# EAGLE design Adafruit MOSFET Driver STEMMA Breakout (EAGLE 9.6.2)
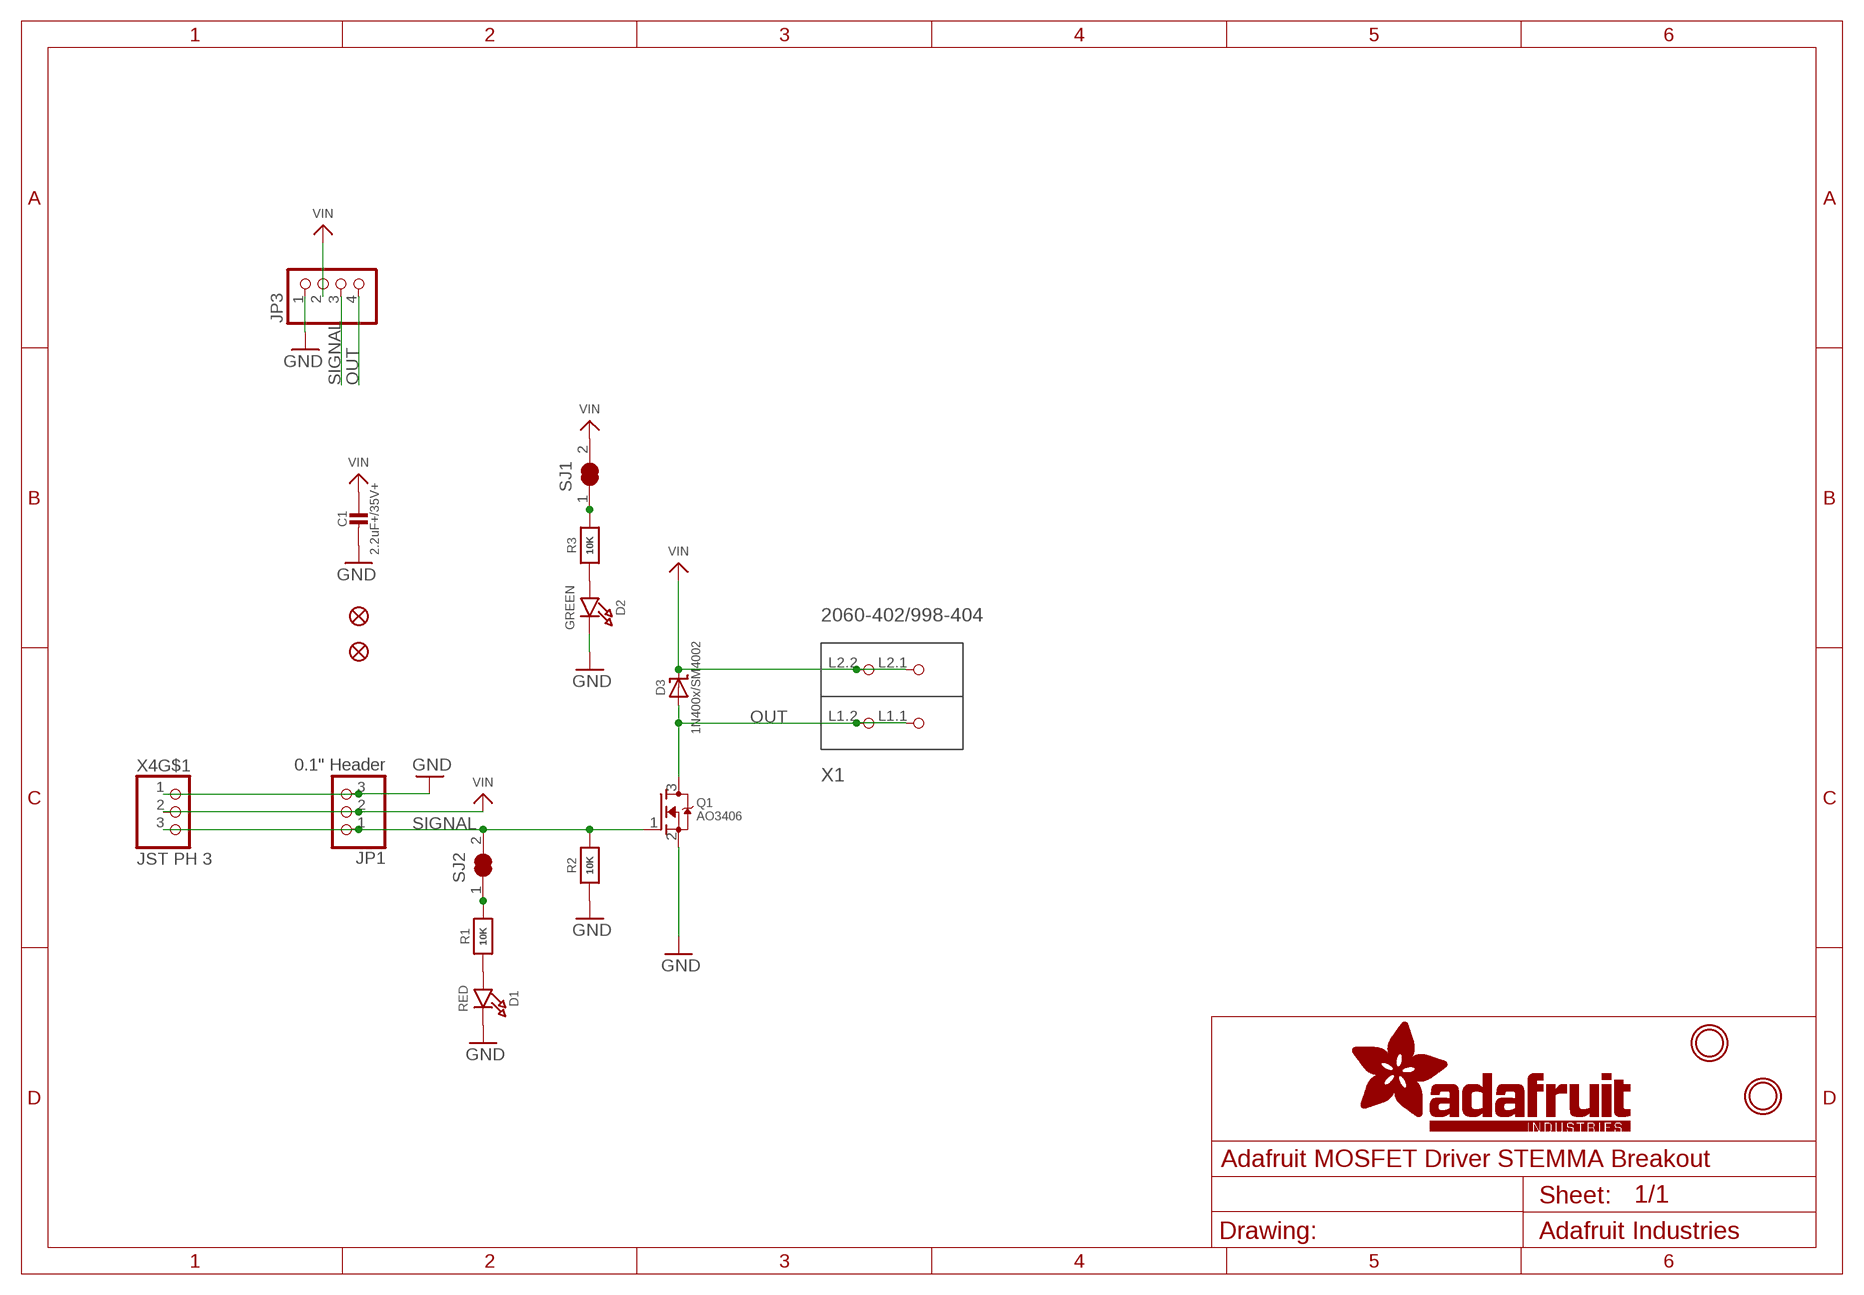
[diagram p0: schematic, sheet 1]

## Parts
C1  2.2uF+/35V+  CAP_CERAMIC0805-NOOUTLINE  [0805-NO]
D1  RED  LED0603_NOOUTLINE  [CHIPLED_0603_NOOUTLINE]
D2  GREEN  LED0603_NOOUTLINE  [CHIPLED_0603_NOOUTLINE]
D3  1N400x/SM4002  DIODE-SCHOTTKYSOD-123  [SOD-123]
FID2  FIDUCIAL_1MM  [FIDUCIAL_1MM]
FID3  FIDUCIAL_1MM  [FIDUCIAL_1MM]
JP1  0.1" Header  HEADER-1X3  [1X03_OVAL]
JP3  HEADER-1X4ROUND  [1X04_ROUND]
Q1  AO3406  MOSFET-NWIDE  [SOT23-WIDE]
R1  10K  RESISTOR_0603_NOOUT  [0603-NO]
R2  10K  RESISTOR_0603_NOOUT  [0603-NO]
R3  10K  RESISTOR_0603_NOOUT  [0603-NO]
SJ1  SOLDERJUMPER_CLOSED  [SOLDERJUMPER_CLOSEDWIRE]
SJ2  SOLDERJUMPER_CLOSED  [SOLDERJUMPER_CLOSEDWIRE]
U$1  MOUNTINGHOLE2.5  [MOUNTINGHOLE_2.5_PLATED]
U$8  MOUNTINGHOLE2.5  [MOUNTINGHOLE_2.5_PLATED]
X1  2060-402/998-404  [P-2060-402/998-404]
X4  JST PH 3  CON_JST_PH_3PIN  [JSTPH3]

## Nets
GND: C1.2 D1.C D2.C JP1.3 JP3.1 Q1.2(S) R2.1 X4.1
N$1: R3.2 SJ1.1
N$2: D1.A R1.1
N$3: R1.2 SJ2.1
N$26: D2.A R3.1
OUT: D3.A JP3.4 Q1.3(D) X1.L1.1(P1.1) X1.L1.2(P1.2)
SIGNAL: JP1.1 JP3.3 Q1.1(G) R2.2 SJ2.2 X4.3
VIN: C1.1 D3.C JP1.2 JP3.2 SJ1.2 X1.L2.1(P2.1) X1.L2.2(P2.2) X4.2
Unconnected: X4.NC1(MT) X4.NC2(MT)

## Library data of the parts
C1 = microbuilder:CAP_CERAMIC: Ceramic Capacitors For new designs, use the packages preceded by an '_' character since they are more reliable: The following footprints should be used on most boards: _0402 - Standard footprint for regular board layouts _0603 - Standard footprint for regular board layouts _0805 - Standard footprint for regular board layouts _1206 - Standard footprint for regular board layouts For extremely tight-pitch boards where space is at a premium, the following 'micro-pitch' footprints can be used (smaller pads, no silkscreen outline, etc.): _0402MP - Micro-pitch footprint for very dense/compact boards _0603MP - Micro-pitch footprint for very dense/compact boards _0805MP - Micro-pitch footprint for very dense/compact boards _1206MP - Micro-pitch footprint for very dense/compact boards
D1 D2 = microbuilder:LED: LED 0603 - 0603 Surface Mount Package 2mA: Green LED - Low Power (3.9mcd, 2ma, 1.7Vf) - Digikey: 475-2709-2-ND Orange LED - Low Power (9.8mcd, 2ma, 1.8Vf) - Digikey: 475-1194-2-ND Red LED - Low Power (5mcd, 2ma, 1.8Vf) - Digikey: 475-1195-2-ND Yellow LED - Low Power (7mcd, 2ma, 1.8Vf) - Digikey: 475-1196-2-ND 5mA: Blue LED - Low Power (17mcd, 5ma, 2.9Vf) - Digikey: LNJ937W8CRACT-ND 0805 - 0805 Surface Mount Package 2mA: Red LED (8.8mcd, 2mA, 1.8Vf, Clear) - Low Power [Digikey: 475-2510-1-ND] Green LED (5mcd, 2mA, 1.8Vf, Clear) - Low Power [Digikey: 475-2730-1-ND] Yellow LED (11.3mcd, 2mA, 1.8Vf, Clear) - Low Power [Digikey: 475-2555-1-ND] 20mA: Red LED (104mcd, 20mA, Diffused) - LS R976 [Digikey: 475-1278-6-ND] Red LED (12mcd, 20mA, 2.0Vf, Clear) - APT2012EC [Digikey: 754-1128-1-ND] Green LED (15mcd, 20mA, 2.2Vf, Clear) - APT2012GC [Digikey: 754-1131-1-ND] Orange LED (160mcd, 20mA, 2.1Vf, Clear) - APT2012SECK [Digikey: 754-1130-1-ND] 1206 - 1206 Surface Mount Package Green LED (26mcd, 20mA, Diffused) - LG N971 [Digikey: 475-1407-6-ND] Red LED (15mcd, 20mA, Diffused) - LH N974 [Digikey: 475-1416-6-ND] Cree - Cree High-Power Surface Mount LEDs XPEBWT-L1-0000-00D50 - White 111lm 350mA 2.9Vf 6200K 110° XTEAWT-00-0000-00000LEE3 - White 114lm 350mA 2.85Vf 5000K 115° Everlight - Everlight 45-21 Series Surface Mount LEDs 45-21/QK2C-B2832AC2CB2/2T - Warm White 2000mcd 20mA 3.25Vf 3050K 120° 45-21/LK2C-B38452C4CB2/2T - Nuetral White 2000mcd 20mA 3.25Vf 4150K 120° 45-21/LK2C-B50634C6CB2/2T - Cold White 2200mcd 20mA 3.25Vf 5650K 120° PLCC2 Reverse Mount LS T77K-J1L2-1-0-2-R18-Z - Red 11.25mcd 2mA 1.8Vf 630nm 120° LO T77K-L1M2-24-Z - Orange 19.6mcd 2mA 1.8Vf 606nm 120° LY T77K-K2M1-26-Z - Yellow 15.7mcd 2mA 1.8Vf 587nm 120°; ROT: 270
D3 = microbuilder:DIODE-SCHOTTKY
FID2 FID3 = microbuilder:FIDUCIAL: Fiducial Alignment Points Various fiducial points for machine vision alignment.; BOM: EXCLUDE
JP1 = microbuilder:HEADER-1X3: PIN HEADER
JP3 = microbuilder:HEADER-1X4: PIN HEADER
Q1 = microbuilder:MOSFET-N: N-Channel Mosfet LEGEND VDS: Voltage Drain-Source ID: Drain Current RDS(ON): Drain-Source On-State Resistance VGS(TH): Gate-Source Threshold Voltage CISS: Drain-Source Input Capacitance SOT-23 Name VDS ID RDS(ON) VGS(TH) CISS Order Number 2N7002E 60V 260mA 2.5 Ohm 2.5V @ 250uA 26.7pF @ 25V 2N7002ET1GOSTR-ND BSH103 30V 850mA 400 mOhm 400mV @ 1mA 83pF @ 24V BSH103,235-ND BSS138 60V 320mA 1.6 Ohm 1.5V @ 250uA 50pF @ 10V Mouser: 771-BSS138PW115 DMN2075U-7 20V 4.2A 38 mOhm 1V @ 250 uA 594.3pF @ 10V DMN2075U-7DICT-ND * BSS138 good choice for I2C level-shifting POWERPAK 1212-8 Name VDS ID RDS(ON) VGS(TH) CISS Order Number Si7308DN 60V 6A 58 mOhm 3V @ 250uA 665pF @ 15V SI7308DN-T1-E3CT-ND
R1-R3 = microbuilder:RESISTOR: Resistors For new designs, use the packages preceded by an '_' character since they are more reliable: The following footprints should be used on most boards: _0402 - Standard footprint for regular board layouts _0603 - Standard footprint for regular board layouts _0805 - Standard footprint for regular board layouts _1206 - Standard footprint for regular board layouts For extremely tight-pitch boards where space is at a premium, the following 'micro-pitch' footprints can be used (smaller pads, no silkscreen outline, etc.): _0402MP - Micro-pitch footprint for very dense/compact boards _0603MP - Micro-pitch footprint for very dense/compact boards _0805MP - Micro-pitch footprint for very dense/compact boards _1206MP - Micro-pitch footprint for very dense/compact boards
SJ1 SJ2 = microbuilder:SOLDERJUMPER_CLOSED: Solder Jumper - Closed These solder jumpers are closed by default CLOSEDWIRE - 10 mil trace between pads that can be cut and resoldered later CLOSEDPERM - 63 mil trace between pads for a permanent connection (used to 'bridge' two signals, a shameless hack for Eagle). Can double as a test point as well (no cream layer)
U$1 U$8 = adafruit_electromech:MOUNTINGHOLE: Mounting Hole For #2 screws (0.086"/2.18mm width, 0.094"/2.4mm hole) use 2.5mm; BOM: EXCLUDE
X1 = adafruit_electromech:2060-402/998-404: Serie 2060, SMD-Leiterplattenklemme mit Betätigungsdrückern im Gurt 2-polig / Series 2060, SMD terminal block with push-buttons in tape-and-reel packing 2-pole Polzahl / Pole No.: 2 Rastermaß / Pitch: 4 mm Bemessungsspannung / Rated Voltage: 160 V Nennstrom / Nominal Current: 9 A Leiterquerschnitt / Conductor Size: 0.2 - 0.75 mm2 Anschlusstechnik / Connection Technology: CAGE CLAMP® S Leitereinführung (zur Platine) / Conductor entry angle (to PCB): 0 ° Farbe / Color: lichtgrau / light gray Stand: 01.01.2014. Die jeweils aktuellen Daten zu diesem Artikel finden Sie in unserem Produktkatalog, den Sie unter www.wago.com einsehen können. As of: 01/01/2014. Please find the newest data for this article in our product catalogue, which can be viewed under www.wago.com.; ROT: 180
X4 = adafruit_electromech:CON_JST_PH_3PIN

## Net classes
1 HV: width 0.406 mm, drill 0.381 mm, clearance 0.762 mm

## Board
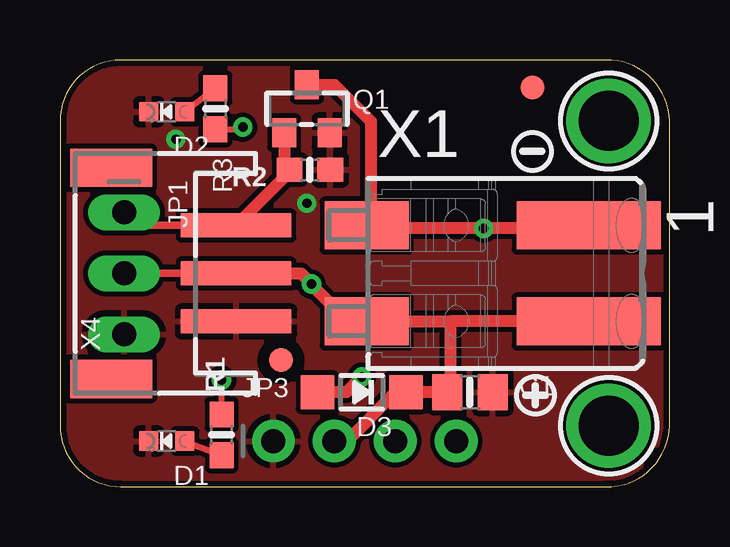
[diagram p1: board, top side]
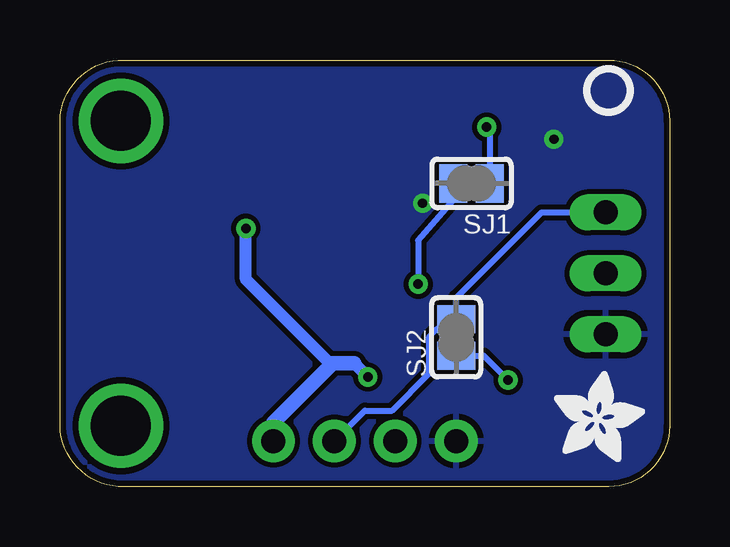
[diagram p2: board, bottom side, seen from below]

Size 25.4 x 17.78 mm. Coordinates in mm from the lower left corner, seen from the top.
Outline: 0,15.24 0,2.54 arc90 2.54,0 22.73,0 arc90 25.4,2.54 25.4,15.24 arc90 22.73,17.78 2.54,17.78 arc90 0,15.24
Copper layers (1*16): Top 0.035mm / dielectric 1.5mm / Bottom 0.035mm
Design rules "adafruit": minimum track width 8mil, minimum drill 15.5mil, track to track 8mil, track to pad 8mil, pad to pad 8mil, via to via 8mil, smd to smd 8mil, copper to edge 10mil, drill to drill 8mil, minimum pad ring 10mil, minimum via ring 8mil, stop-mask expansion 2mil, vias tented up to drill 20mil, thermal gap 10mil

### Footprints (pad centres in the part's own frame; a part is rotated, then mirrored left to right if it is on the bottom)
0805-NO = smd 1.24 x 1.5: 1 -0.95,0; 2 0.95,0
CHIPLED_0603_NOOUTLINE = smd 0.8 x 0.8: A 0,-0.75; C 0,0.75
SOD-123 = smd 1.4 x 1.4: A 1.85,0; C -1.85,0
FIDUCIAL_1MM = smd 1 x 1: 1 0,0
1X03_OVAL = drill 1 long: 1 -2.54,0; 2 0,0; 3 2.54,0
1X04_ROUND = drill 1 pad 1.778: 1 -3.81,0; 2 -1.27,0; 3 1.27,0; 4 3.81,0
SOT23-WIDE = smd 1 x 1.2: 1 -0.95,-1; 2 0.95,-1; 3 0,1
0603-NO = smd 1.075 x 1: 1 -0.85,0; 2 0.85,0
SOLDERJUMPER_CLOSEDWIRE = smd 1.168 x 1.6: 1 -0.762,0; 2 0.762,0 | smd 0.635 x 0.203: WIRE 0,0
MOUNTINGHOLE_2.5_PLATED = drill 2.5 pad 3.2: P$1 0,0
P-2060-402/998-404 = smd 6 x 2: L1.1 4.371,2; L2.1 4.371,-2 | smd 3.5 x 2: L1.2 -4.879,2; L2.2 -4.879,-2
JSTPH3 = smd 1 x 4.6: 1 -2,-2.7; 2 0,-2.7; 3 2,-2.7 | smd 1.6 x 3.4: NC1 -4.4,2.5; NC2 4.4,2.5

### Placement (x,y rotation side)
C1  17.08,3.94 0 top
D1  4.45,1.91 90 top
D2  4.45,15.62 90 top
D3  12.57,3.94 180 top
FID2  19.68,16.64 0 top
FID3  9.21,5.27 0 top
JP1  2.67,8.89 270 top
JP3  12.7,1.91 0 top
PLABEL0  [PLABEL0]  1.02,15.11 0 top
PLABEL1  [PLABEL1]  1.14,1.52 0 top
PLABEL2  [PLABEL2]  12.83,13.34 0 top
PLABEL3  [PLABEL3]  9.91,8.38 0 bottom
PLABEL4  [PLABEL4]  6.48,12.57 0 bottom
PLABEL5  [PLABEL5]  6.1,11.56 0 bottom
PLABEL6  [PLABEL6]  6.86,8.89 0 bottom
PLABEL7  [PLABEL7]  7.62,6.35 0 bottom
PLABEL8  [PLABEL8]  25.27,9.02 0 bottom
PLABEL9  [PLABEL9]  14.61,3.56 0 bottom
PLABEL10  [PLABEL10]  12.45,3.43 0 bottom
PLABEL11  [PLABEL11]  9.78,3.56 0 bottom
PLABEL12  [PLABEL12]  18.16,3.56 0 bottom
PLABEL13  [PLABEL13]  20.57,15.75 0 bottom
Q1  10.29,15.75 0 top
R1  6.73,2.16 90 top
R2  10.41,13.21 180 top
R3  6.48,15.75 270 top
SJ1  8.26,12.64 180 bottom
SJ2  8.89,6.22 90 bottom
U$1  22.86,2.54 0 top
U$3  [SYMBOL_PLUS]  19.81,3.81 0 top
U$5  [PCBFEAT-REV-040]  2.54,16.51 180 bottom
U$8  22.86,15.24 0 top
U$9  [SYMBOL_MINUS]  19.68,13.97 0 top
U$12  [ADAFRUIT_3.5MM]  4.83,1.02 0 bottom
X1  17.65,8.89 0 top
X4  4.64,8.89 90 top

### Tracks (layer width: path | path; a pad name or v marks a point on that pad's centre or on a via)
GND  (via drill 0.39)
  other vias: 4.83,14.48 10.29,11.81
  pour Top: 0,17.78 25.4,17.78 25.4,0 0,0
  pour Bottom: 0,17.78 25.4,17.78 25.4,0 0,0
N$1  (via drill 0.39)
  Top 0.254: 7.49,14.99 7.51,14.9 R3.2 | 7.49,14.99 v7.62,14.99 | 7.49,14.99
  Bottom 0.254: v7.62,14.99 7.49,14.86 SJ1.1
N$2
  Top 0.254: D1.A R1.1
N$3  (via drill 0.39)
  Top 0.254: R1.2 v6.73,4.45
  Bottom 0.254: SJ2.1 7.75,5.46 v6.73,4.45
N$26
  Top 0.254: D2.A R3.1
OUT  (via drill 0.39)
  Top 0.508: X1.L1.1 21.9,10.76 v17.65,10.76 12.9,10.76 X1.L1.2 12.95,11.07 12.95,15.22 11.43,16.75 Q1.3 | v12.57,4.57 11.94,3.94 D3.A
  Bottom 0.508: 13.14,5.14 v12.57,4.57 13.21,5.21 14.22,5.21 17.65,8.64 v17.65,10.76
  Bottom 0.61: JP3.4 16.51,2.67 14.03,5.14 13.14,5.14
SIGNAL
  Top 0.305: JP1.1 3.21,10.89 X4.3
  Top 0.508: X4.3 9.23,12.79 9.56,13.09 R2.2 9.34,13.44 Q1.1
  Bottom 0.254: JP1.1 5.33,11.43 8.89,7.87 SJ2.2 9.27,6.99 10.03,6.22 10.03,4.7 11.56,3.17 12.7,3.17 JP3.3
VIN  (via drill 0.39)
  Top 0.305: X4.2 JP1.2
  Top 0.508: 16.26,6.89 21.37,6.89 21.46,6.99 21.93,6.99 X1.L2.1 | 16.26,6.89 16.26,4.06 C1.1 D3.C 13.97,3.94 11.94,1.91 JP3.2 | X4.2 10.03,8.89 v10.48,8.45 12.03,6.89 X1.L2.2 16.26,6.89
  Bottom 0.254: SJ1.2 9.02,11.95 10.48,10.27 v10.48,8.45

### Text on the board
Pinguin_tBackup: ON | Motor/ / MOSFET / Driver | Sig
Pinguin_bBackup: Adafruit STEMMA / MOSFET+Diode Driver | In | On | V+ | LED, Motor, Solenoid / Out+Vin, Out- Switched / 1.5A Cont. Current / Power:3~30VDC / Logic/PWM:3~20VDC | Sig | GND | GND | Out | V+ | In